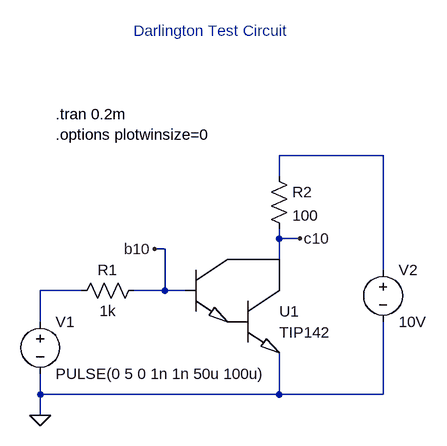
[diagram p0: schematic TIP142_test.asc]
TIP142_test.asc, the LTspice schematic file:
Version 4
SHEET 1 1856 2244
WIRE 432 -112 272 -112
WIRE 272 -80 272 -112
WIRE 272 16 272 0
WIRE 304 16 272 16
WIRE 96 32 80 32
WIRE 272 48 272 16
WIRE 432 64 432 -112
WIRE -32 96 -96 96
WIRE 96 96 96 32
WIRE 96 96 48 96
WIRE 128 96 96 96
WIRE -96 144 -96 96
WIRE -96 256 -96 224
WIRE 272 256 272 192
WIRE 272 256 -96 256
WIRE 432 256 432 144
WIRE 432 256 272 256
WIRE -96 288 -96 256
FLAG -96 288 0
FLAG 304 16 c10
FLAG 80 32 b10
SYMBOL res -48 112 R270
WINDOW 0 32 56 VTop 0
WINDOW 3 0 56 VBottom 0
SYMATTR InstName R1
SYMATTR Value 1k
SYMBOL voltage -96 128 R0
WINDOW 123 0 0 Left 0
WINDOW 39 0 0 Left 0
SYMATTR InstName V1
SYMATTR Value PULSE(0 5 0 1n 1n 50u 100u)
SYMBOL voltage 432 48 R0
SYMATTR InstName V2
SYMATTR Value 10V
SYMBOL res 256 -96 R0
SYMATTR InstName R2
SYMATTR Value 100
SYMBOL Darlington\\NpnDarlington 144 48 R0
SYMATTR InstName U1
SYMATTR SpiceModel TIP142
TEXT -72 -176 Left 0 !.tran 0.2m
TEXT 48 -304 Left 0 ;Darlington Test Circuit
TEXT -72 -144 Left 0 !.options plotwinsize=0

The netlist it stands for:
* TIP142_test.asc
R1 N002 b10 1k
V1 N002 0 PULSE(0 5 0 1n 1n 50u 100u)
V2 N001 0 10V
R2 N001 c10 100
XU1 c10 b10 0 TIP142  ; pins C B E
.tran 0.2m
* Darlington Test Circuit
.options plotwinsize=0
.backanno
.end